# EAGLE design retroduino (EAGLE 9.2.1)
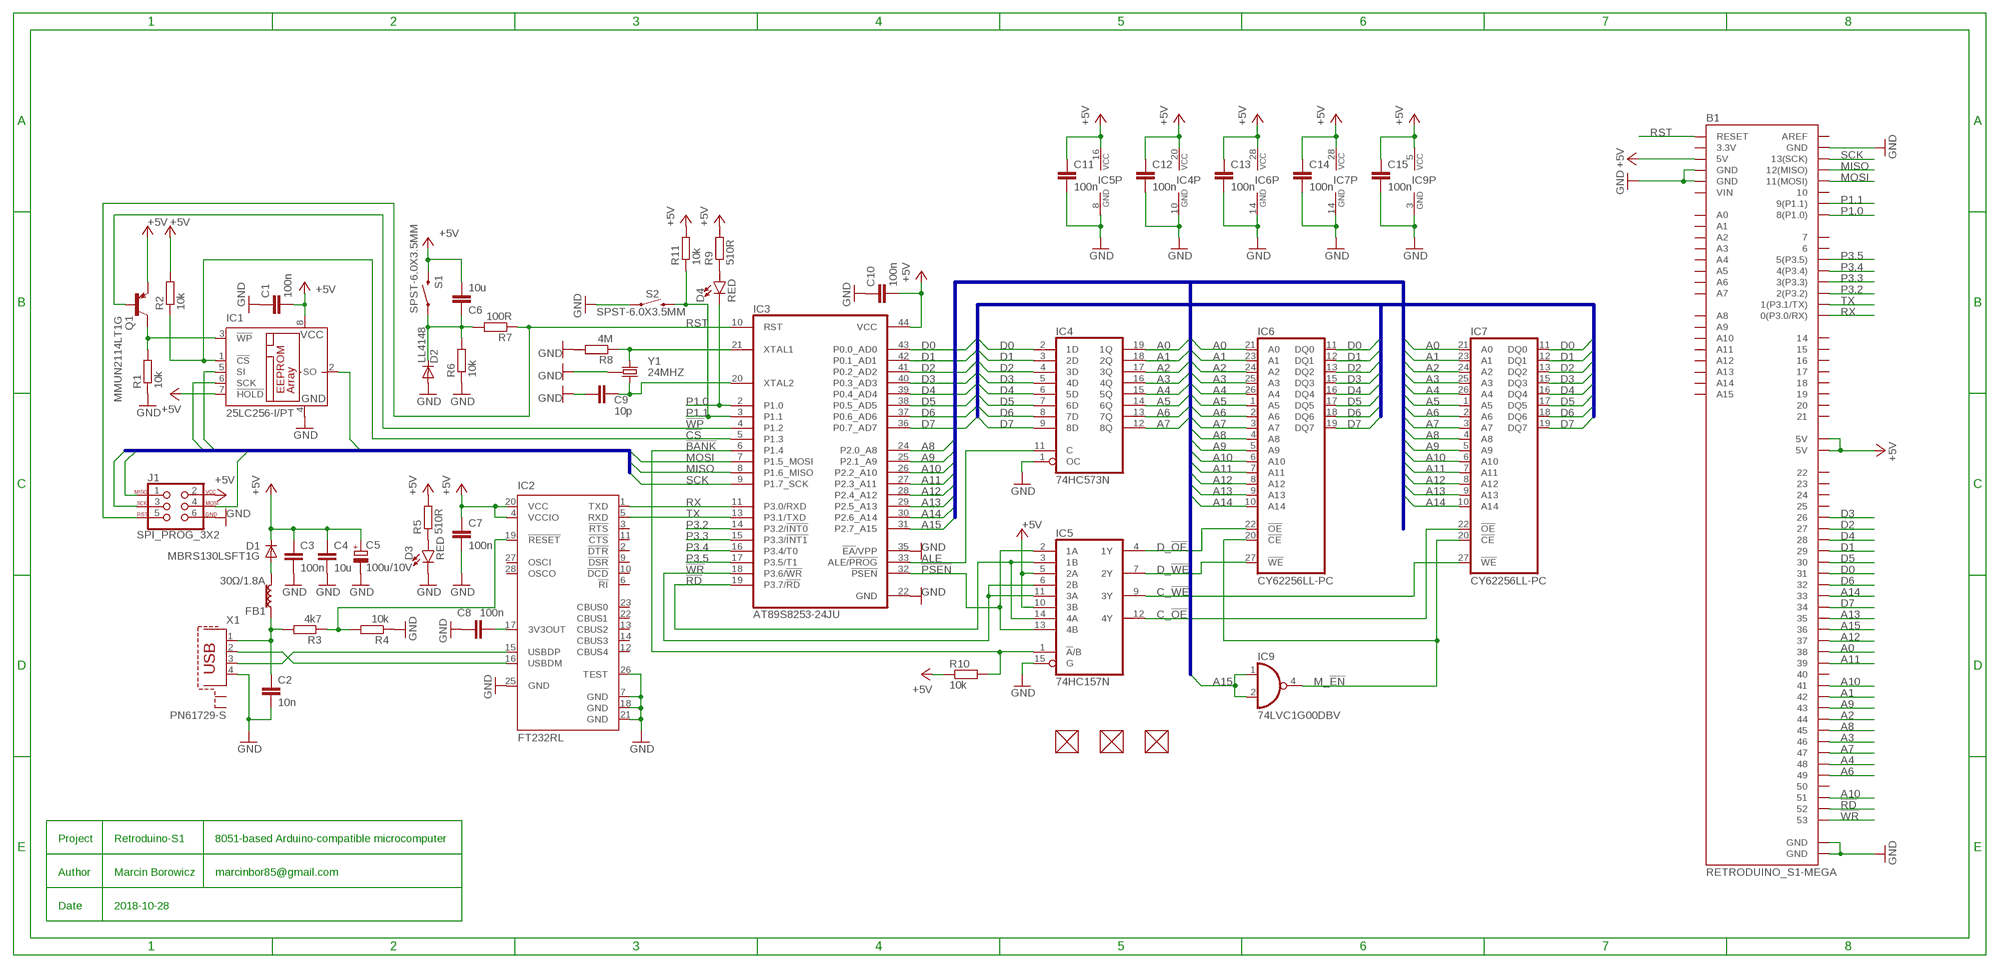
[diagram p0: schematic, sheet 1]

## Parts
B1  RETRODUINO_S1-MEGA  [RETRODUINO_S1]
C1  100n  C-EUC0603  [C0603]
C2  10n  C-EUC0603  [C0603]
C3  100n  C-EUC0603  [C0603]
C4  10u  C-EUC1206  [C1206]
C5  100u/10V  CPOL-EUSMCC  [SMC_C]
C6  10u  C-EUC1206  [C1206]
C7  100n  C-EUC0603  [C0603]
C8  100n  C-EUC0603  [C0603]
C9  10p  C-EUC0603  [C0603]
C10  100n  C-EUC0603  [C0603]
C11  100n  C-EUC0603  [C0603]
C12  100n  C-EUC0603  [C0603]
C13  100n  C-EUC0603  [C0603]
C14  100n  C-EUC0603  [C0603]
C15  100n  C-EUC0603  [C0603]
D1  MBRS130LSFT1G  DIODE-SOD123  [SOD123]
D2  LL4148  DIODE-MICROMELF-R  [MICROMELF-R]
D3  RED  LED-RED0603  [LED-0603]
D4  RED  LED-RED0603  [LED-0603]
FB1  30Ω/1.8A  FERRITE_BEAD-0603  [0603]
FUD1  FIDUCIAL  [GHI_FIDUCIAL_40MIL]
FUD2  FIDUCIAL  [GHI_FIDUCIAL_40MIL]
FUD3  FIDUCIAL  [GHI_FIDUCIAL_40MIL]
IC1  25LC256-I/PT  25LC080P  [DIL8]
IC2  FT232RL  [SSOP28]
IC3  AT89S8253-24JU  AT89S51-S  [S44]
IC4  74HC573N  [DIL20]
IC5  74HC157N  [DIL16]
IC6  CY62256LL-PC  [DIL28-6]
IC7  CY62256LL-PC  [DIL28-6]
IC9  74LVC1G00DBV  [SOT23-5]
J1  SPI_PROG_3X2  AVR_SPI_PROG_3X2NS  [2X3-NS]
Q1  MMUN2114LT1G  BC857BSMD  [SOT23-BEC]
R1  10k  R-EU_R0603  [R0603]
R2  10k  R-EU_R0603  [R0603]
R3  4k7  R-EU_R0603  [R0603]
R4  10k  R-EU_R0603  [R0603]
R5  510R  R-EU_R0603  [R0603]
R6  10k  R-EU_R0603  [R0603]
R7  100R  R-EU_R0603  [R0603]
R8  4M  R-EU_R0603  [R0603]
R9  510R  R-EU_R0603  [R0603]
R10  10k  R-EU_R0603  [R0603]
R11  10k  R-EU_R0603  [R0603]
S1  SPST-6.0X3.5MM  MOMENTARY-SWITCH-SPST-SMD-6.0X3.5MM  [TACTILE_SWITCH_SMD_6.0X3.5MM]
S2  SPST-6.0X3.5MM  MOMENTARY-SWITCH-SPST-SMD-6.0X3.5MM  [TACTILE_SWITCH_SMD_6.0X3.5MM]
X1  PN61729-S  [PN61729-S]
Y1  24MHZ  CRYSTAL-26MHZSMD-3.2X2.5  [CRYSTAL-SMD-3.2X2.5MM]

## Nets
!BANK: IC3.6(P1.4) IC5.1(!A!/B) R10.2
!CS: IC1.1(!CS) IC3.5(P1.3) R2.1
!PSEN: IC3.32(!PSEN) IC5.2(1A) IC5.13(4B)
!RD: B1.52 IC3.19(P3.7/!RD) IC5.3(1B) IC5.14(4A)
!WP: IC3.4(P1.2) Q1.B
!WR: B1.53 IC3.18(P3.6/!WR) IC5.6(2B) IC5.11(3A)
+5V: B1.5V@0(5V) B1.5V@1(5V) B1.5V@2(5V) C1.2 C3.1 C4.1 C5.+ C6.1 C7.1 C10.2 C11.1 C12.1 C13.1 C14.1 C15.1 D1.C IC1.7(!HOLD) IC1.8(VCC) IC2.4(VCCIO) IC2.20(VCC) IC3.44(VCC) IC4.20(VCC) IC5.5(2A) IC5.10(3B) IC5.16(VCC) IC6.28(VCC) IC7.28(VCC) IC9.5(VCC) J1.2 Q1.E R2.2 R5.2 R9.2 R10.1 R11.2 S1.2
A0: B1.38 IC4.19(1Q) IC6.21(A0) IC7.21(A0)
A1: B1.42 IC4.18(2Q) IC6.23(A1) IC7.23(A1)
A2: B1.44 IC4.17(3Q) IC6.24(A2) IC7.24(A2)
A3: B1.46 IC4.16(4Q) IC6.25(A3) IC7.25(A3)
A4: B1.48 IC4.15(5Q) IC6.26(A4) IC7.26(A4)
A5: IC4.14(6Q) IC6.1(A5) IC7.1(A5)
A6: B1.49 IC4.13(7Q) IC6.2(A6) IC7.2(A6)
A7: B1.47 IC4.12(8Q) IC6.3(A7) IC7.3(A7)
A8: B1.45 IC3.24(P2.0_A8) IC6.4(A8) IC7.4(A8)
A9: B1.43 IC3.25(P2.1_A9) IC6.5(A9) IC7.5(A9)
A10: B1.41 B1.51 IC3.26(P2.2_A10) IC6.6(A10) IC7.6(A10)
A11: B1.39 IC3.27(P2.3_A11) IC6.7(A11) IC7.7(A11)
A12: B1.37 IC3.28(P2.4_A12) IC6.8(A12) IC7.8(A12)
A13: B1.35 IC3.29(P2.5_A13) IC6.9(A13) IC7.9(A13)
A14: B1.33 IC3.30(P2.6_A14) IC6.10(A14) IC7.10(A14)
A15: B1.36 IC3.31(P2.7_A15) IC9.1(I0) IC9.2(I1)
ALE: IC3.33(ALE/!PROG) IC4.11(C)
C_!OE: IC5.12(4Y) IC7.22(!OE)
C_!WE: IC5.9(3Y) IC7.27(!WE)
D0: B1.31 IC3.43(P0.0_AD0) IC4.2(1D) IC6.11(DQ0) IC7.11(DQ0)
D1: B1.29 IC3.42(P0.1_AD1) IC4.3(2D) IC6.12(DQ1) IC7.12(DQ1)
D2: B1.27 IC3.41(P0.2_AD2) IC4.4(3D) IC6.13(DQ2) IC7.13(DQ2)
D3: B1.26 IC3.40(P0.3_AD3) IC4.5(4D) IC6.15(DQ3) IC7.15(DQ3)
D4: B1.28 IC3.39(P0.4_AD4) IC4.6(5D) IC6.16(DQ4) IC7.16(DQ4)
D5: B1.30 IC3.38(P0.5_AD5) IC4.7(6D) IC6.17(DQ5) IC7.17(DQ5)
D6: B1.32 IC3.37(P0.6_AD6) IC4.8(7D) IC6.18(DQ6) IC7.18(DQ6)
D7: B1.34 IC3.36(P0.7_AD7) IC4.9(8D) IC6.19(DQ7) IC7.19(DQ7)
D_!OE: IC5.4(1Y) IC6.22(!OE)
D_!WE: IC5.7(2Y) IC6.27(!WE)
GND: B1.GND@0(GND) B1.GND@1(GND) B1.GND@2(GND) B1.GND@3(GND) B1.GND@4(GND) C1.1 C2.2 C3.2 C4.2 C5.- C7.2 C8.2 C9.1 C10.1 C11.2 C12.2 C13.2 C14.2 C15.2 D2.A D3.C IC1.4(GND) IC2.7(GND) IC2.18(GND) IC2.21(GND) IC2.25(GND) IC2.26(TEST) IC3.35(!EA!/VPP) IC4.1(OC) IC4.10(GND) IC5.8(GND) IC5.15(G) IC6.14(GND) IC7.14(GND) IC9.3(GND) J1.6 R1.1 R4.1 R6.1 R8.2 S2.1 X1.4 Y1.2 Y1.4
M_!EN: IC6.20(!CE) IC7.20(!CE) IC9.4(O)
MISO: B1.12(12(MISO)) IC1.2(SO) IC3.8(P1.6_MISO) J1.1
MOSI: B1.11(11(MOSI)) IC1.5(SI) IC3.7(P1.5_MOSI) J1.4
N$9: IC3.22(GND) ; supply symbol labelled GND
N$10: C9.2 IC3.20(XTAL2) Y1.3
N$11: IC3.21(XTAL1) R8.1 Y1.1
N$12: C6.2 D2.C R6.2 R7.2 S1.1
N$20: D3.A R5.1
N$21: D4.A R9.1
N$23: IC2.16(USBDM) X1.2
N$24: C8.1 IC2.17(3V3OUT)
N$25: IC2.15(USBDP) X1.3
N$27: C2.1 FB1.1 R3.2 X1.1
N$29: IC1.3(!WP) Q1.C R1.2
N$31: D1.A FB1.2
N$41: IC2.19(!RESET) R3.1 R4.2
P1.0: B1.8(8(P1.0)) D4.C IC3.2(P1.0)
P1.1: B1.9(9(P1.1)) IC3.3(P1.1) R11.1 S2.2
P3.2: B1.2(2(P3.2)) IC3.14(P3.2/!INT0)
P3.3: B1.3(3(P3.3)) IC3.15(P3.3/!INT1)
P3.4: B1.4(4(P3.4)) IC3.16(P3.4/T0)
P3.5: B1.5(5(P3.5)) IC3.17(P3.5/T1)
RST: B1.RESET IC3.10(RST) J1.5 R7.1
RX: B1.0(0(P3.0/RX)) IC2.1(TXD) IC3.11(P3.0/RXD)
SCK: B1.13(13(SCK)) IC1.6(SCK) IC3.9(P1.7_SCK) J1.3
TX: B1.1(1(P3.1/TX)) IC2.5(RXD) IC3.13(P3.1/TXD)
Unconnected: B1.3V3(3.3V) B1.6 B1.7 B1.10 B1.14 B1.15 B1.16 B1.17 B1.18 B1.19 B1.20 B1.21 B1.22 B1.23 B1.24 B1.25 B1.40 B1.50 B1.A0 B1.A1 B1.A2 B1.A3 B1.A4 B1.A5 B1.A6 B1.A7 B1.A8 B1.A9 B1.A10 B1.A11 B1.A12 B1.A13 B1.A14 B1.A15 B1.AREF B1.VIN FUD1.P$1 FUD2.P$1 FUD3.P$1 IC2.2(!DTR) IC2.3(!RTS) IC2.6(!RI) IC2.9(!DSR) IC2.10(!DCD) IC2.11(!CTS) IC2.12(CBUS4) IC2.13(CBUS2) IC2.14(CBUS3) IC2.22(CBUS1) IC2.23(CBUS0) IC2.27(OSCI) IC2.28(OSCO) X1.S1 X1.S2

## Buses
D:D0,D1,D2,D3,D4,D5,D6,D7
A:A0,A1,A2,A3,A4,A5,A6,A7,A8,A9,A10,A11,A12,A13,A14,A15
SPI:MISO,MOSI,SCK

## Notes on the sheet
- Project | Retroduino-S1 | 8051-based Arduino-compatible microcomputer
- Author | Marcin Borowicz | marcinbor85@gmail.com
- Date | 2018-10-28

## Library data of the parts
B1 = SparkFun-Boards:RETRODUINO_S1: Arduino Mega R3 ATmega2560 R3 compatible footprint. SparkFun Products: Arduino Mega 2560 R3 <https://www.sparkfun.com/products/11061>
C1-C4 C6-C15 = rcl:C-EU: CAPACITOR, European symbol; SPICEPREFIX: C
C5 = rcl:CPOL-EU: POLARIZED CAPACITOR, European symbol; SPICEPREFIX: C
D1 D2 = diode:DIODE-: DIODE
D3 D4 = SparkFun-LED:LED-RED: Red SMD LED Used in manufacturing of most products at SparkFun Packages: 0603 - SMD 0603 package [Product Link] <http://docs.avagotech.com/docs/AV02-0551EN> 0603 SMART - SMD 0603 SMART package ( more efficient and expensive)[Product Link] <http://www.osram-os.com/Graphics/XPic2/00077099_0.pdf> 1206 - SMD1206 package [Product Link] <https://www.sparkfun.com/datasheets/DevTools/LilyPad/Q150OVS4.pdff> SparkFun Products: Pro Mini 328 -5V <https://www.sparkfun.com/products/821> RedBoard <https://www.sparkfun.com/products/12757> IOIO-OTG <https://www.sparkfun.com/products/13613>; PROD_ID: DIO-00819
FB1 = SparkFun-Coils:FERRITE_BEAD: Ferrite Bead (blocks, cores, rings, chokes, etc.) Inductor with layers of ferrite used to suppress high frequencies. Often used to isolate high frequency noise. SparkFun Products: IOIO-OTG - V2.2 <https://www.sparkfun.com/products/13613> SparkFun SAMD21 Mini Breakout <https://www.sparkfun.com/products/13664> SparkFun 6 Degrees of Freedom Breakout - LSM6DS3 <https://www.sparkfun.com/products/13339> SparkFun SAMD21 Dev Breakout <https://www.sparkfun.com/products/13672>; PROD_ID: NDUC-07859
FUD1-FUD3 = BeagleBone_Blue_R3:FIDUCIAL
IC1 = microchip:25*: Serial EEPROM 4K/ 8K , SPI bus; MF: MICROCHIP; MPN: 25LC080/P; OC_FARNELL: 1556143; OC_NEWARK: 92C7440
IC2 = ftdichip:FT232R: Source: http://www.ftdichip.com/Documents/DataSheets/DS_FT232R_v104.pdf; MPN: FT232RL; OC_FARNELL: 1146032; OC_NEWARK: 91K9918
IC3 = atmel:AT89S51-*: 8-bit Microcontroller with 4K BytesIn-System Programmable Flash Source: http://www.atmel.com/dyn/resources/prod_documents/doc2487.pdf; OC_FARNELL: unknown; OC_NEWARK: unknown
IC4 = 74xx-eu:74*573: 8-bit D latch BUS DRIVER
IC5 = 74xx-eu:74*157: Quadruple 2-line to 1-line data SELECTOR/MULTIPLEXER
IC6 IC7 = memory-sram:CY62256LL-?*: 256K (32K x 8) CMOS-Static RAM Source: http://download.cypress.com.edgesuite.net/design_resources/datasheets/contents/cy62256_8.pdf
IC9 = 74xx-little-de:74*1G00: 2-input NAND gate
J1 = SparkFun-Connectors:AVR_SPI_PROG_3X2: AVR ISP 6 Pin This is the reduced ISP connector for AVR programming. Common on Arduino. This footprint will take up less PCB space and can be used with a 10-pin to 6-pin adapter such as SKU: BOB-08508 **Special note about "TEST_POINT" package. The stop mask is on the top side, so if you want your programming test points to be on the bottom of your board, make sure to place this package on the bottom side of the board. This also ensure that the orientation to program from the bottom side will be correct. SparkFun Products: SparkFun ISP Pogo Adapter <https://www.sparkfun.com/products/11591> - NS Tiny AVR Programmer <https://www.sparkfun.com/products/11801> -PTH
Q1 = transistor-pnp:BC857*: PNP Transistror
R1-R11 = rcl:R-EU_: RESISTOR, European symbol; SPICEPREFIX: R
S1 S2 = SparkFun-Switches:MOMENTARY-SWITCH-SPST: Momentary Switch (Pushbutton) - SPST Normally-open (NO) SPST momentary switches (buttons, pushbuttons). Variants PTH-12MM - 12mm square, through-hole Momentary Pushbutton Switch - 12mm Square <https://www.sparkfun.com/products/9190> (COM-09190) PTH-6.0MM, PTH-6.0MM-KIT - 6.0mm square, through-hole Mini Pushbutton Switch <https://www.sparkfun.com/products/97> (COM-00097) KIT package intended for soldering kit's - only one side of pads' copper is exposed. PTH-RIGHT-ANGLE-KIT - Right-angle, through-hole Right Angle Tactile Button <https://www.sparkfun.com/products/10791> - Used on SparkFun BigTime Watch Kit <https://www.sparkfun.com/products/11734> SMD-12MM - 12mm square, surface-mount Tactile Button - SMD (12mm) <https://www.sparkfun.com/products/12993> (COM-12993) Used on SparkFun PicoBoard <https://www.sparkfun.com/products/11888> SMD-4.5MM - 4.5mm Square Trackball Switch Used on SparkFun Blackberry Trackballer Breakout <https://www.sparkfun.com/products/13169> SMD-4.6MMX2.8MM - 4.60mm x 2.80mm, surface mount Used on SparkFun SAMD21 Mini Breakout <https://www.sparkfun.com/products/13664> SMD-5.2MM, SMD-5.2-REDUNDANT - 5.2mm square, surface-mount Mini Pushbutton Switch - SMD <https://www.sparkfun.com/products/8720> (COM-08720) Used on Arduino Pro Mini <https://www.sparkfun.com/products/11114> REDUNDANT package connects both switch circuits together SMD-6.0X3.5MM - 6.0 x 3.5mm, surface mount Momentary Reset Switch SMD <https://www.sparkfun.com/products/8229> (COM-08229) SMD-6.2MM-TALL - 6.2mm square, surface mount Tactile Button - SMD (6mm) <https://www.sparkfun.com/products/12992> Used on SparkFun Digital Sandbox <https://www.sparkfun.com/products/12651> SMD-RIGHT-ANGLE - Right-angle, surface mount Used on SparkFun Block for Intel® Edison - Arduino <https://www.sparkfun.com/products/13036>; PROD_ID: SWCH-00815; SF_SKU: COM-08229
X1 = con-berg:PN61729-S: BERG USB connector; OC_FARNELL: unknown; OC_NEWARK: unknown
Y1 = SparkFun-Clocks:CRYSTAL-26MHZ: 26MHz Crystal w/ Ground Pin Digikey Example <http://www.digikey.com/product-detail/en/epson/TSX-3225%2026.0000MF09Z-AC3/SER3627CT-ND/1802878> Frequency: 26MHz Frequency Stability: ±9ppm Frequency Tolerance: ±10ppm Load Capacitance: 9pF SparkFun Products: SparkFun ESP32 Thing <https://www.sparkfun.com/products/13907> SparkFun ESP8266 Thing Dev Board <https://www.sparkfun.com/products/13711>; PROD_ID: XTAL-12454

## Board
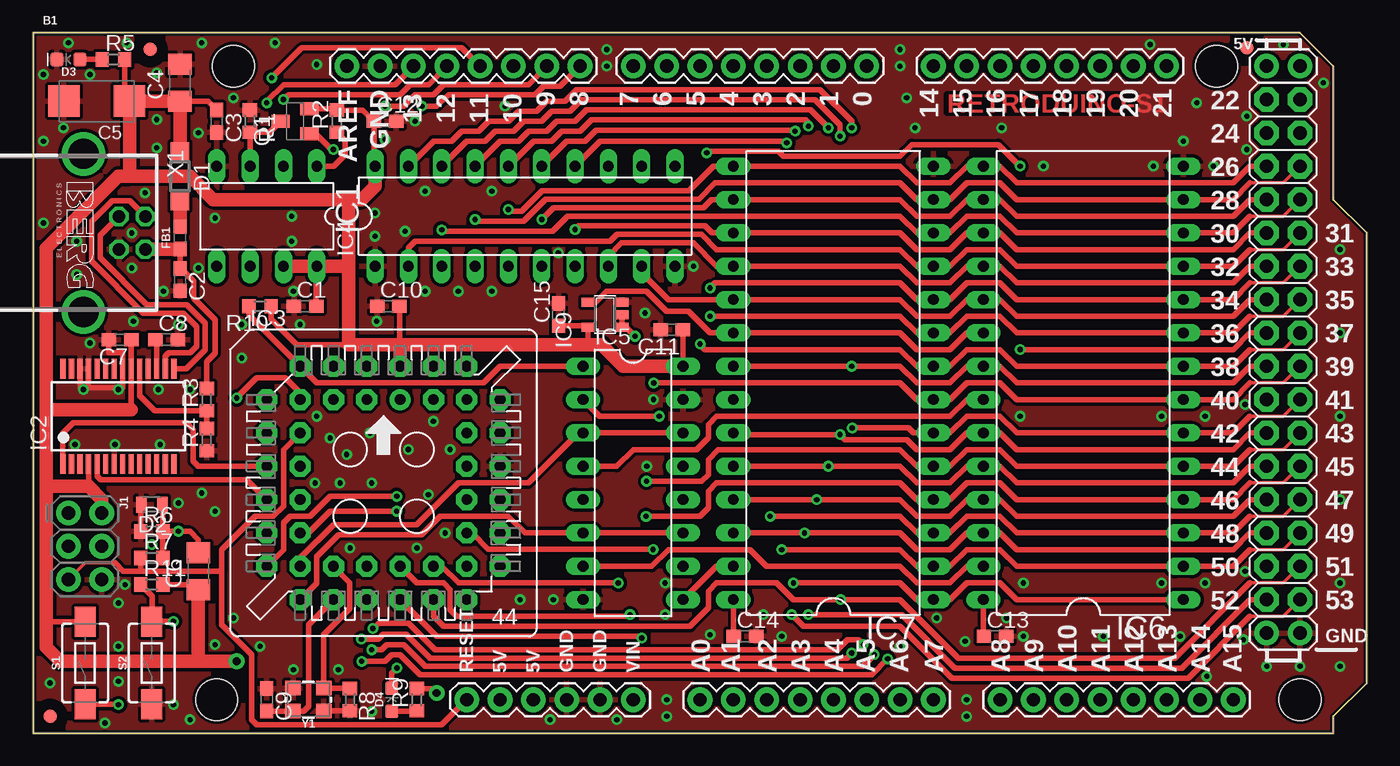
[diagram p1: board, top side]
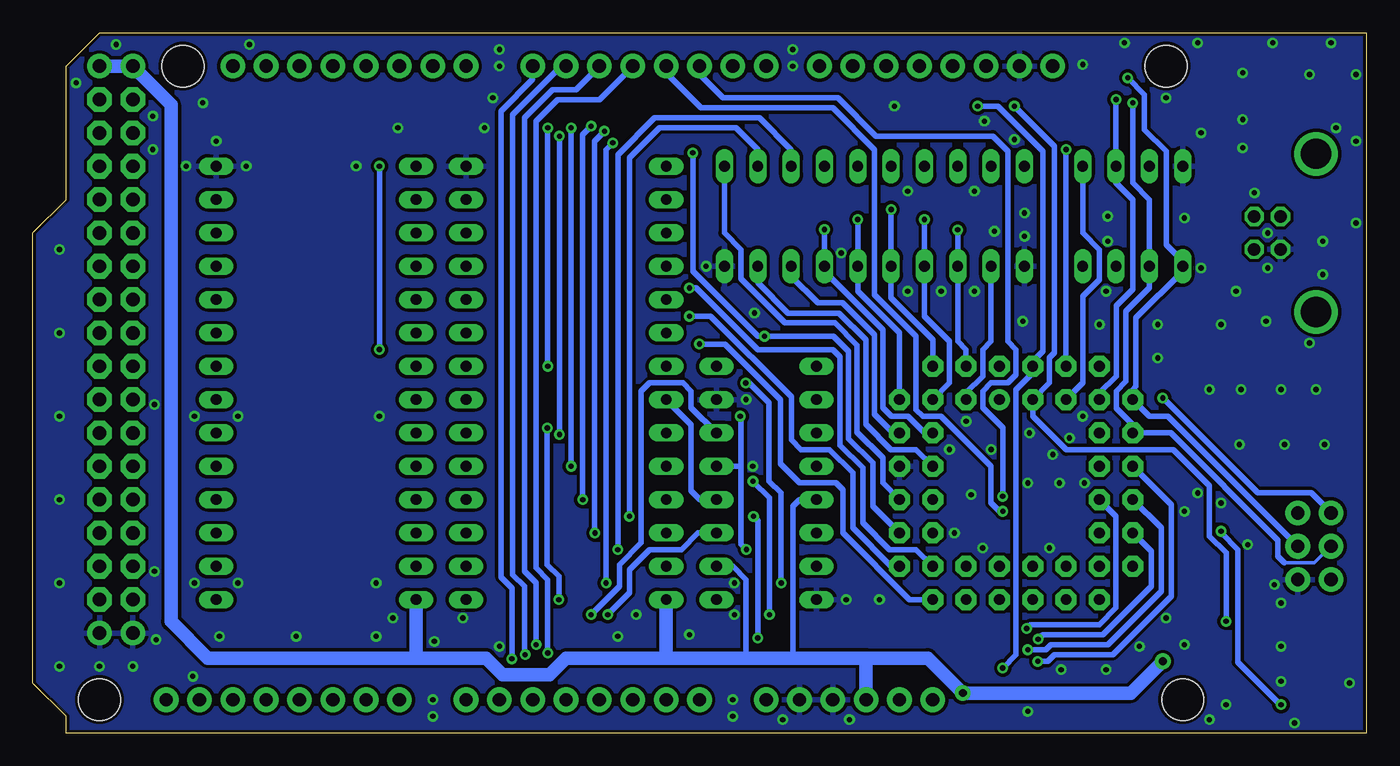
[diagram p2: board, bottom side, seen from below]

Size 101.6 x 53.34 mm. Coordinates in mm from the lower left corner, seen from the top.
Outline: 0,0 99.06,0 99.06,1.27 101.6,3.81 101.6,38.1 99.06,40.64 99.06,50.8 96.52,53.34 0,53.34 0,0
Copper layers (1*16): Top 0.035mm / dielectric 1.5mm / Bottom 0.035mm
Design rules "default *": minimum track width 0.25mm, minimum drill 0.4mm, track to track 0.2mm, track to pad 0.2mm, pad to pad 0.2mm, via to via 0.2mm, smd to smd 0.2mm, copper to edge 0.2mm, drill to drill 0.2mm, minimum pad ring 10mil, minimum via ring 8mil, stop-mask expansion 4mil, vias tented up to drill 0.6mm, thermal gap 10mil

### Footprints (pad centres in the part's own frame; a part is rotated, then mirrored left to right if it is on the bottom)
RETRODUINO_S1 = drill 1.016 pad 1.88: 0 13.97,24.13; 1 11.43,24.13; 2 8.89,24.13; 3 6.35,24.13; 3V3 -13.97,-24.13; 4 3.81,24.13; 5 1.27,24.13; 5V@0 -11.43,-24.13; 5V@1 44.45,24.13; 5V@2 46.99,24.13; 6 -1.27,24.13; 7 -3.81,24.13; 8 -7.874,24.13; 9 -10.414,24.13; 10 -12.954,24.13; 11 -15.494,24.13; 12 -18.034,24.13; 13 -20.574,24.13; 14 19.05,24.13; 15 21.59,24.13; 16 24.13,24.13; 17 26.67,24.13; 18 29.21,24.13; 19 31.75,24.13; 20 34.29,24.13; 21 36.83,24.13; A0 1.27,-24.13; A1 3.81,-24.13; A2 6.35,-24.13; A3 8.89,-24.13; A4 11.43,-24.13; A5 13.97,-24.13; A6 16.51,-24.13; A7 19.05,-24.13; A8 24.13,-24.13; A9 26.67,-24.13; A10 29.21,-24.13; A11 31.75,-24.13; A12 34.29,-24.13; A13 36.83,-24.13; A14 39.37,-24.13; A15 41.91,-24.13; AREF -25.654,24.13; GND@0 -8.89,-24.13; GND@1 -6.35,-24.13; GND@2 44.45,-19.05; GND@3 46.99,-19.05; GND@4 -23.114,24.13; RESET -16.51,-24.13; VIN -3.81,-24.13 | drill 1.016 pad 1.88 octagon: 22 44.45,21.59; 23 46.99,21.59; 24 44.45,19.05; 25 46.99,19.05; 26 44.45,16.51; 27 46.99,16.51; 28 44.45,13.97; 29 46.99,13.97; 30 44.45,11.43; 31 46.99,11.43; 32 44.45,8.89; 33 46.99,8.89; 34 44.45,6.35; 35 46.99,6.35; 36 44.45,3.81; 37 46.99,3.81; 38 44.45,1.27; 39 46.99,1.27; 40 44.45,-1.27; 41 46.99,-1.27; 42 44.45,-3.81; 43 46.99,-3.81; 44 44.45,-6.35; 45 46.99,-6.35; 46 44.45,-8.89; 47 46.99,-8.89; 48 44.45,-11.43; 49 46.99,-11.43; 50 44.45,-13.97; 51 46.99,-13.97; 52 44.45,-16.51; 53 46.99,-16.51 | hole 3.2: -34.29,24.13; -35.56,-24.13; 40.64,24.13; 46.99,-24.13
C0603 = smd 1.1 x 1: 1 -0.85,0; 2 0.85,0
C1206 = smd 1.6 x 1.8: 1 -1.4,0; 2 1.4,0
SMC_C = smd 2.4 x 2.4: + -2.5,0; - 2.5,0
SOD123 = smd 1.4 x 1.4: A 1.9,0; C -1.9,0
MICROMELF-R = smd 0.8 x 1.2: A 0.8,0; C -0.8,0
LED-0603 = smd 1 x 1: A -0.877,0; C 0.877,0
0603 = smd 1.1 x 1: 1 -0.85,0; 2 0.85,0
GHI_FIDUCIAL_40MIL = smd 1.016 x 1.016: P$1 0,0
DIL8 = drill 0.813 long: 1 -3.81,-3.81; 2 -1.27,-3.81; 3 1.27,-3.81; 4 3.81,-3.81; 5 3.81,3.81; 6 1.27,3.81; 7 -1.27,3.81; 8 -3.81,3.81
SSOP28 = smd 0.4 x 1.5: 1 -4.225,-3.625; 2 -3.575,-3.625; 3 -2.925,-3.625; 4 -2.275,-3.625; 5 -1.625,-3.625; 6 -0.975,-3.625; 7 -0.325,-3.625; 8 0.325,-3.625; 9 0.975,-3.625; 10 1.625,-3.625; 11 2.275,-3.625; 12 2.925,-3.625; 13 3.575,-3.625; 14 4.225,-3.625; 15 4.225,3.625; 16 3.575,3.625; 17 2.925,3.625; 18 2.275,3.625; 19 1.625,3.625; 20 0.975,3.625; 21 0.325,3.625; 22 -0.325,3.625; 23 -0.975,3.625; 24 -1.625,3.625; 25 -2.275,3.625; 26 -2.925,3.625; 27 -3.575,3.625; 28 -4.225,3.625
S44 = drill 0.813 pad 1.6: 1 1.27,6.35 | drill 0.813 pad 1.6 octagon: 2 -1.27,8.89; 3 -1.27,6.35; 4 -3.81,8.89; 5 -3.81,6.35; 6 -6.35,8.89; 7 -8.89,6.35; 8 -6.35,6.35; 9 -8.89,3.81; 10 -6.35,3.81; 11 -8.89,1.27; 12 -6.35,1.27; 13 -8.89,-1.27; 14 -6.35,-1.27; 15 -8.89,-3.81; 16 -6.35,-3.81; 17 -8.89,-6.35; 18 -6.35,-8.89; 19 -6.35,-6.35; 20 -3.81,-8.89; 21 -3.81,-6.35; 22 -1.27,-8.89; 23 -1.27,-6.35; 24 1.27,-8.89; 25 1.27,-6.35; 26 3.81,-8.89; 27 3.81,-6.35; 28 6.35,-8.89; 29 8.89,-6.35; 30 6.35,-6.35; 31 8.89,-3.81; 32 6.35,-3.81; 33 8.89,-1.27; 34 6.35,-1.27; 35 8.89,1.27; 36 6.35,1.27; 37 8.89,3.81; 38 6.35,3.81; 39 8.89,6.35; 40 6.35,8.89; 41 6.35,6.35; 42 3.81,8.89; 43 3.81,6.35; 44 1.27,8.89
DIL20 = drill 0.813 long: 1 -11.43,-3.81; 2 -8.89,-3.81; 3 -6.35,-3.81; 4 -3.81,-3.81; 5 -1.27,-3.81; 6 1.27,-3.81; 7 3.81,-3.81; 8 6.35,-3.81; 9 8.89,-3.81; 10 11.43,-3.81; 11 11.43,3.81; 12 8.89,3.81; 13 6.35,3.81; 14 3.81,3.81; 15 1.27,3.81; 16 -1.27,3.81; 17 -3.81,3.81; 18 -6.35,3.81; 19 -8.89,3.81; 20 -11.43,3.81
DIL16 = drill 0.813 long: 1 -8.89,-3.81; 2 -6.35,-3.81; 3 -3.81,-3.81; 4 -1.27,-3.81; 5 1.27,-3.81; 6 3.81,-3.81; 7 6.35,-3.81; 8 8.89,-3.81; 9 8.89,3.81; 10 6.35,3.81; 11 3.81,3.81; 12 1.27,3.81; 13 -1.27,3.81; 14 -3.81,3.81; 15 -6.35,3.81; 16 -8.89,3.81
DIL28-6 = drill 0.813 long: 1 -16.51,-7.62; 2 -13.97,-7.62; 3 -11.43,-7.62; 4 -8.89,-7.62; 5 -6.35,-7.62; 6 -3.81,-7.62; 7 -1.27,-7.62; 8 1.27,-7.62; 9 3.81,-7.62; 10 6.35,-7.62; 11 8.89,-7.62; 12 11.43,-7.62; 13 13.97,-7.62; 14 16.51,-7.62; 15 16.51,7.62; 16 13.97,7.62; 17 11.43,7.62; 18 8.89,7.62; 19 6.35,7.62; 20 3.81,7.62; 21 1.27,7.62; 22 -1.27,7.62; 23 -3.81,7.62; 24 -6.35,7.62; 25 -8.89,7.62; 26 -11.43,7.62; 27 -13.97,7.62; 28 -16.51,7.62
SOT23-5 = smd 0.69 x 0.99: 1 -0.95,-1.29; 2 0,-1.29; 3 0.95,-1.29; 4 0.95,1.3; 5 -0.95,1.3
2X3-NS = drill 1.016 pad 1.88: 1 -2.54,-1.27; 2 -2.54,1.27; 3 0,-1.27; 4 0,1.27; 5 2.54,-1.27; 6 2.54,1.27
SOT23-BEC = smd 1 x 1.4: B -0.95,-1.1; C 0,1.1; E 0.95,-1.1
R0603 = smd 1 x 1.1: 1 -0.85,0; 2 0.85,0
TACTILE_SWITCH_SMD_6.0X3.5MM = smd 2.3 x 1.6: 1 -3.15,0; 2 3.15,0
PN61729-S = drill 0.95 octagon: 1 1.25,4.71; 2 -1.25,4.71; 3 -1.25,2.71; 4 1.25,2.71 | drill 2.3 pad 2.9: S1 -6.02,0; S2 6.02,0
CRYSTAL-SMD-3.2X2.5MM = smd 1.2 x 1.1: 1 -1.175,-0.875; 2 1.175,-0.875; 3 1.175,0.875; 4 -1.175,0.875

### Placement (x,y rotation side)
B1  49.53,26.67 0 top
C1  20.7,32.51 0 top
C2  11.18,34.54 270 top
C3  13.97,46.61 270 top
C4  11.18,49.53 90 top
C5  4.83,48.13 180 top
C6  12.57,12.32 90 top
C7  6.6,29.97 180 top
C8  10.16,29.97 0 top
C9  17.78,2.54 270 top
C10  27.05,32.51 0 top
C11  48.64,30.73 180 top
C12  26.8,46.61 0 top
C13  73.28,7.37 0 top
C14  54.23,7.37 0 top
C15  40.01,31.88 90 top
D1  11.18,42.42 270 top
D2  9.02,17.4 180 top
D3  2.67,51.31 180 top
D4  27.3,2.54 90 top
FB1  11.18,37.72 90 top
FUD1  8.89,52.07 0 top
FUD2  92.46,52.2 0 top
FUD3  1.27,1.27 0 top
IC1  17.78,39.37 180 top
IC2  6.48,24.13 0 top
IC3  26.67,19.05 0 top
IC4  37.47,39.37 0 top
IC5  45.69,19.05 270 top
IC6  80.01,26.67 90 top
IC7  60.96,26.67 90 top
IC9  43.56,31.88 90 top
J1  3.94,14.22 270 top
Q1  19.94,46.61 90 top
R1  16.51,46.61 270 top
R2  23.11,46.61 90 top
R3  13.21,25.4 90 top
R4  13.21,22.35 90 top
R5  6.1,51.31 0 top
R6  9.02,15.37 0 top
R7  9.02,13.34 0 top
R8  24.13,2.54 270 top
R9  29.21,2.54 90 top
R10  17.27,32.51 180 top
R11  9.02,11.3 0 top
S1  3.94,5.33 90 top
S2  9.02,5.33 90 top
X1  3.81,38.1 270 top
Y1  20.95,2.54 180 top

### Tracks (layer width: path | path; a pad name or v marks a point on that pad's centre or on a via)
!BANK
  Top 0.4: IC5.1 35.56,27.94 34.29,26.67 21.59,26.67 IC3.6 16.42,31.84 R10.2
!CS
  Top 0.4: R2.1 23.75,45.12 23.75,44.07 22.86,43.18 IC1.1
  Bottom 0.4: IC3.5 21.57,26.69 21.57,33.28 20.32,34.53 20.32,36.83 21.59,38.1 IC1.1
!PSEN  (via drill 0.4)
  Top 0.4: IC3.32 33.41,15.24 34.66,13.99 v47.22,13.99 | IC5.2 43.16,24.13 v47.69,24.13
  Bottom 0.4: v47.69,24.13 47.62,24.07 47.62,20.32 | IC5.13 47.62,20.32 | 47.62,20.32 47.62,14.39 v47.22,13.99
!RD  (via drill 0.4)
  Top 0.4: IC3.19 20.32,13.34 22.86,15.88 29.21,15.88 32.38,19.05 37.72,19.05 41.53,22.86 IC5.3 IC5.14 | v59.05,9.02 66.17,9.02 70.23,4.95 87.5,4.95 92.71,10.16 B1.52
  Bottom 0.4: IC5.14 51.44,24.79 51.44,26.04 52.07,26.67 54.61,26.67 55.24,26.04 55.24,14.48 56.9,12.83 56.9,11.18 v59.05,9.02
!WP  (via drill 0.4)
  Top 0.4: v22.86,44.45 22.73,44.45 21.52,45.66 Q1.B
  Bottom 0.4: IC3.4 v22.86,44.45
!WR  (via drill 0.4)
  Top 0.25: 92.71,8.89 95.25,8.89 B1.53
  Top 0.4: IC3.18 21.57,11.41 21.57,13.44 23.24,15.11 29.59,15.11 30.99,16.51 36.18,16.51 37.45,15.24 IC5.6 IC5.11 | v57.78,9.02 58.67,8.13 66.04,8.13 69.98,4.19 88.01,4.19 92.71,8.89
  Bottom 0.4: IC5.11 50.9,15.24 52.17,13.97 54.61,13.97 56.13,12.45 56.13,10.67 v57.78,9.02
+5V  (via drill 0.6 pad 1.2)
  Top 0.4: C7.1 IC2.20 7.45,24.64 | IC2.4 4.2,18.8 | R5.2 6.95,48.51 | C11.1 49.49,27.95 IC5.16 | v30.73,3.05 30.7,3.05 30.35,3.39 R9.2 | IC7.28 53.34,7.41 C14.1 | IC6.28 72.39,7.41 C13.1 | S1.2 0.99,8.48 | R11.2 12.19,11.3 C6.1 | C3.1 13.3,48.13 C4.1 | Q1.E 23.01,47.56 R2.2 25.1,47.46 C12.1 25.95,43.27 IC4.20 | C1.2 21.55,35.52 | C10.2 27.9,29.63 27.94,29.59 | C15.1 42.16,31.03 IC9.5 42.26,29.94 41.91,29.59 | R10.1 18.12,31.54 20.07,29.59 24,29.59
  Top 1.016: IC1.8 IC1.7 | 27.94,29.59 IC3.44 | 21.55,35.52 IC1.8 | 24,40.64 13.72,40.64 11.94,42.42 7.37,42.42 | 24,40.64 24,35.56 | 24,35.56 24,29.59 27.94,29.59 | IC1.8 24,35.56 | J1.2 5.21,17.78 4.2,18.79 | C5.+ 7.37,48.09 arc90 C5.+ 7.33,42.46 7.37,42.42 | 7.37,42.42 6.48,42.42 0.97,36.91 0.97,24.64 | 24,40.64 25.02,40.64 26.04,41.66 IC4.20 | C5.+ C4.1 D1.C | 6.95,48.51 C5.+ | IC5.16 44.92,27.94 43.29,29.59 41.91,29.59 27.94,29.59 | 4.2,18.8 4.2,18.79 | 0.97,18.8 0.97,24.64 | 7.45,24.64 0.97,24.64 | 4.2,18.79 0.98,18.79 0.97,18.8 | 0.97,18.8 0.97,8.51 | 0.97,8.51 0.97,6.52 2.03,5.46 12.7,5.46 | 12.7,5.46 v15.49,5.46 | 0.99,8.48 0.97,8.51 | C6.1 12.57,5.59 12.7,5.46
  Bottom 0.4: IC5.5 43.18,17.78 43.69,17.27 43.69,5.71 | IC5.10 48.26,12.7 47.24,11.68 47.24,5.71
  Bottom 1.016: v15.49,5.46 17.91,3.05 v30.73,3.05 33.4,5.71 38.1,5.71 | B1.5V@0 38.1,5.71 | IC7.28 53.34,5.71 | 38.1,5.71 43.69,5.71 47.24,5.71 53.34,5.71 | 53.34,5.71 60.96,5.71 62.23,4.45 65.79,4.45 67.06,5.71 72.39,5.71 | B1.5V@2 B1.5V@1 91.06,47.88 91.06,8.51 88.27,5.71 72.39,5.71 | IC6.28 72.39,5.71
A0  (via drill 0.4)
  Top 0.4: IC7.21 v62.36,27.94 66.04,27.94 67.31,26.67 69.85,26.67 71.12,27.94 IC6.21 73.66,27.94 74.93,26.67 91.44,26.67 92.71,27.94 B1.38 | IC4.19 30.48,45.09 31.88,45.09 32.64,45.85 33.91,45.85 34.67,46.61 36.2,46.61 36.96,47.37 38.35,47.37 39.12,48.13 40.51,48.13 41.4,49.02 59.94,49.02 62.36,46.61 v62.36,46.1
  Bottom 0.4: v62.36,46.1 v62.36,27.94
A1  (via drill 0.4)
  Top 0.4: IC7.23 53.47,22.73 v61.47,22.73 61.85,22.35 66.55,22.35 67.31,21.59 69.85,21.59 71.12,22.86 IC6.23 73.66,22.86 74.93,21.59 91.44,21.59 92.71,22.86 B1.42 | IC4.18 33.02,45.09 34.42,45.09 35.18,45.85 36.58,45.85 37.34,46.61 38.73,46.61 39.5,47.37 40.89,47.37 41.78,48.26 59.56,48.26 61.47,46.35 v61.47,45.47
  Bottom 0.4: v61.47,45.47 v61.47,22.73
A2  (via drill 0.4)
  Top 0.4: IC7.24 v60.58,20.32 66.04,20.32 67.31,19.05 69.85,19.05 71.12,20.32 IC6.24 73.66,20.32 74.93,19.05 91.44,19.05 92.71,20.32 B1.44 | IC4.17 35.56,45.09 36.96,45.09 37.72,45.85 39.12,45.85 39.88,46.61 41.27,46.61 42.15,47.48 59.2,47.48 v60.58,46.1 | v60.58,46.1 | v60.58,46.1
  Bottom 0.4: v60.58,20.32 v60.58,46.1
A3  (via drill 0.4)
  Top 0.4: IC7.25 v59.69,17.78 66.04,17.78 67.31,16.51 69.85,16.51 71.12,17.78 IC6.25 73.66,17.78 74.93,16.51 91.44,16.51 92.71,17.78 B1.46 | IC4.16 38.1,45.09 39.5,45.09 40.26,45.85 41.66,45.85 42.52,46.71 58.83,46.71 59.05,46.48 v59.05,46.23
  Bottom 0.4: v59.05,46.23 59.69,45.59 v59.69,17.78
A4  (via drill 0.4)
  Top 0.4: IC7.26 v58.77,15.24 66.04,15.24 67.31,13.97 69.85,13.97 71.12,15.24 IC6.26 73.66,15.24 74.93,13.97 91.44,13.97 92.71,15.24 B1.48 | IC4.15 40.64,45.09 42.04,45.09 42.88,45.93 57.96,45.93 v58.04,45.85
  Bottom 0.4: v58.77,15.24 58.8,15.28 58.8,45.09 v58.04,45.85
A5  (via drill 0.4)
  Top 0.4: IC6.1 74.93,10.16 73.66,11.43 71.12,11.43 69.85,10.16 IC7.1 67.31,10.16 66.04,11.43 v57.91,11.43 | IC4.14 43.18,45.09 57.28,45.09 v57.4,44.96
  Bottom 0.4: v57.4,44.96 57.91,44.45 v57.91,11.43
A6  (via drill 0.4)
  Top 0.25: 92.71,13.97 95.25,13.97 B1.49
  Top 0.4: v57.02,13.97 66.04,13.97 67.31,12.7 IC7.2 69.85,12.7 71.12,13.97 73.66,13.97 74.93,12.7 IC6.2 91.44,12.7 92.71,13.97
  Bottom 0.4: v57.02,13.97 57.02,44.07 54.23,46.86 46.23,46.86 43.81,44.45 IC4.13
A7  (via drill 0.4)
  Top 0.25: 92.71,16.51 95.25,16.51 B1.47
  Top 0.4: v56.13,16.51 66.04,16.51 67.31,15.24 IC7.3 69.85,15.24 71.12,16.51 73.66,16.51 74.93,15.24 IC6.3 91.44,15.24 92.71,16.51
  Bottom 0.4: IC4.12 46.35,44.45 48.01,46.1 53.85,46.1 56.13,43.81 v56.13,16.51
A8  (via drill 0.4)
  Top 0.25: 92.71,19.05 95.25,19.05 B1.45
  Top 0.4: v46.68,16.51 50.8,16.51 51.44,17.14 51.44,18.41 52.07,19.05 66.04,19.05 67.31,17.78 IC7.4 69.85,17.78 71.12,19.05 73.66,19.05 74.93,17.78 IC6.4 91.44,17.78 92.71,19.05 | IC3.24 30.73,7.37 46.23,7.37 v46.35,7.24
  Bottom 0.4: v46.68,16.51 46.35,16.18 v46.35,7.24
A9  (via drill 0.4)
  Top 0.25: 92.71,21.59 95.25,21.59 B1.43
  Top 0.4: v46.72,19.18 50.93,19.18 51.44,19.68 51.44,20.83 52.18,21.59 66.04,21.59 67.31,20.32 IC7.5 69.85,20.32 71.12,21.59 73.66,21.59 74.93,20.32 IC6.5 91.44,20.32 92.71,21.59 | v45.47,9.02 45.34,8.89 32.26,8.89 31.75,9.4 31.75,10.92 31.24,11.43 29.21,11.43 IC3.25
  Bottom 0.4: v46.72,19.18 46.72,19.16 45.47,17.91 v45.47,9.02
A10  (via drill 0.4)
  Top 0.25: 92.71,11.43 95.25,11.43 B1.51 | 92.71,24.13 95.25,24.13 B1.41
  Top 0.4: v62.4,23.24 66.67,23.24 67.06,22.86 IC7.6 69.85,22.86 71.12,24.13 73.66,24.13 74.93,22.86 IC6.6 91.44,22.86 92.71,24.13 | IC3.26 30.48,8.89 31.24,8.13 50.04,8.13 51.44,9.53 51.44,10.79 52.07,11.43 56.64,11.43 57.91,10.16 v61.51,10.16 66.04,10.16 70.48,5.71 87,5.71 92.71,11.43
  Bottom 0.4: v62.4,23.24 62.4,12.83 61.51,11.94 v61.51,10.16
A11  (via drill 0.4)
  Top 0.25: 92.71,26.67 95.25,26.67 B1.39
  Top 0.4: v47.26,26.67 66.04,26.67 67.31,25.4 IC7.7 69.85,25.4 71.12,26.67 73.66,26.67 74.93,25.4 IC6.7 91.44,25.4 92.71,26.67 | v44.58,11.43 32.38,11.43 31.11,12.7 IC3.27
  Bottom 0.4: v47.26,26.67 47.01,26.67 45.49,25.15 45.49,19.2 44.58,18.29 v44.58,11.43
A12  (via drill 0.4)
  Top 0.25: 92.71,29.21 95.25,29.21 B1.37
  Top 0.4: v50.8,29.63 50.8,29.59 51.18,29.21 66.04,29.21 67.31,27.94 IC7.8 69.85,27.94 71.12,29.21 73.66,29.21 74.93,27.94 IC6.8 91.44,27.94 92.71,29.21
  Bottom 0.4: v50.8,29.63 48.86,29.63 44.63,25.39 44.63,20.5 43.18,19.05 40.39,19.05 39.88,18.54 39.88,15.25 34.79,10.16 IC3.28
A13  (via drill 0.4)
  Top 0.25: 92.71,31.75 95.25,31.75 B1.35
  Top 0.4: v51.56,31.75 66.04,31.75 67.31,30.48 IC7.9 69.85,30.48 71.12,31.75 73.66,31.75 74.93,30.48 IC6.9 91.44,30.48 92.71,31.75
  Bottom 0.4: IC3.29 36.2,12.7 39.12,15.62 39.12,19.81 40.89,21.59 43.05,21.59 43.8,22.34 43.8,25.61 49.94,31.75 v51.56,31.75
A14  (via drill 0.4)
  Top 0.25: 92.71,34.29 95.25,34.29 B1.33
  Top 0.4: v51.56,33.91 51.94,34.29 66.04,34.29 67.31,33.02 IC7.10 69.85,33.02 71.12,34.29 73.66,34.29 74.93,33.02 IC6.10 91.44,33.02 92.71,34.29
  Bottom 0.4: IC3.30 34.29,13.97 36.32,13.97 38.35,16 38.35,20.19 40.08,21.92 40.08,28.65 40.64,29.21 46.35,29.21 51.05,33.91 v51.56,33.91
A15  (via drill 0.4)
  Top 0.4: B1.36 92.71,30.48 91.44,29.21 v75.18,29.21 | v45.85,30.23 45.15,30.93 IC9.1 IC9.2 | v51.31,44.2 51.44,44.32 56.77,44.32 57.15,43.94 66.04,43.94 66.93,44.83 73.53,44.83 v75.18,43.18
  Bottom 0.4: IC3.31 37.59,17.27 37.59,20.57 39.43,22.41 39.43,29.08 40.57,30.23 v45.85,30.23 46.35,30.23 51.31,35.18 v51.31,44.2 | v75.18,43.18 v75.18,29.21
ALE
  Bottom 0.4: IC3.33 36.83,19.05 36.83,20.95 38.78,22.91 38.78,29.55 40.48,31.24 44.27,31.24 47.62,34.6 47.62,36.83 48.9,38.1 IC4.11
C_!OE
  Bottom 0.4: IC7.22 51.44,23.5 51.44,18.44 50.77,17.78 IC5.12
C_!WE
  Top 0.4: IC5.9 52.05,12.7 IC7.27
D0
  Top 0.25: 92.71,36.83 95.25,36.83 B1.31
  Top 0.4: IC4.2 28.57,36.96 29.08,37.47 29.09,37.47 43.94,37.47 44.47,37.99 50.91,37.99 52.07,36.83 66.04,36.83 67.31,35.56 IC7.11 69.85,35.56 71.12,36.83 73.66,36.83 74.93,35.56 IC6.11 91.44,35.56 92.71,36.83
  Bottom 0.4: IC3.43 30.48,25.91 29.21,27.18 29.21,29.21 28.57,29.84 IC4.2
D1  (via drill 0.4)
  Top 0.25: 92.71,39.37 95.25,39.37 B1.29
  Top 0.4: v31.11,38.33 31.22,38.23 39.56,38.23 40.7,39.37 66.04,39.37 67.31,38.1 IC7.12 69.85,38.1 71.12,39.37 73.66,39.37 74.93,38.1 IC6.12 91.44,38.1 92.71,39.37
  Bottom 0.4: IC3.42 30.48,29.21 31.11,29.84 IC4.3 v31.11,38.33
D2  (via drill 0.4)
  Top 0.25: 92.71,41.91 95.25,41.91 B1.27
  Top 0.4: v33.66,39.12 33.78,38.99 37.34,38.99 39.02,40.67 50.7,40.67 51.94,41.91 66.04,41.91 67.31,40.64 IC7.13 69.85,40.64 71.12,41.91 73.66,41.91 74.93,40.64 IC6.13 91.44,40.64 92.71,41.91
  Bottom 0.4: IC3.41 31.75,26.67 31.75,29.84 33.66,31.75 IC4.4 v33.66,39.12
D3  (via drill 0.4)
  Top 0.4: v36.2,39.88 36.32,39.75 37.18,39.75 38.75,41.32 49.96,41.32 51.82,43.18 IC7.15 66.04,43.18 67.31,41.91 69.85,41.91 71.12,43.18 IC6.15 73.66,43.18 74.93,41.91 91.44,41.91 92.71,43.18 B1.26
  Bottom 0.4: IC3.40 33.02,29.97 36.2,33.15 IC4.5 v36.2,39.88
D4  (via drill 0.4)
  Top 0.254: 71.12,40.64 IC6.16
  Top 0.4: 71.12,40.64 69.85,39.37 67.31,39.37 66.04,40.64 IC7.16 51.69,40.64 51.07,40.02 39.64,40.02 v38.73,39.12 | IC6.16 73.66,40.64 74.93,39.37 91.44,39.37 92.71,40.64 B1.28
  Bottom 0.4: IC3.39 35.56,30.48 38.73,33.66 IC4.6 v38.73,39.12
D5  (via drill 0.4)
  Top 0.4: v41.27,38.35 41.56,38.64 51.18,38.64 51.72,38.1 IC7.17 66.04,38.1 67.31,36.83 69.85,36.83 71.12,38.1 IC6.17 73.66,38.1 74.93,36.83 91.44,36.83 92.71,38.1 B1.30
  Bottom 0.4: IC3.38 33.66,22.86 34.92,24.13 36.19,24.13 36.83,24.77 36.83,30.73 41.27,35.18 IC4.7 v41.27,38.35
D6
  Top 0.4: IC4.8 43.81,36.32 44.83,37.34 50.29,37.34 52.07,35.56 IC7.18 66.04,35.56 67.31,34.29 69.85,34.29 71.12,35.56 IC6.18 73.66,35.56 74.93,34.29 91.44,34.29 92.71,35.56 B1.32
  Bottom 0.4: IC3.37 36.07,22.86 37.48,24.27 37.48,30.34 39.91,32.77 41.78,32.77 43.81,34.8 IC4.8
D7
  Top 0.4: IC4.9 46.35,35.05 48.39,33.02 IC7.19 66.04,33.02 67.31,31.75 69.85,31.75 71.12,33.02 IC6.19 73.66,33.02 74.93,31.75 91.44,31.75 92.71,33.02 B1.34
  Bottom 0.4: IC3.36 34.29,21.59 36.2,21.59 38.13,23.52 38.13,29.94 40.16,31.97 44.04,31.97 46.35,34.29 IC4.9
D_!OE
  Top 0.4: IC6.22 71.12,25.4 69.85,24.13 52.07,24.13 51.44,23.5 51.44,22.48 50.55,21.59 45.72,21.59 44.45,20.32 IC5.4
D_!WE
  Top 0.4: IC6.27 71.12,12.7 69.85,11.43 67.31,11.43 66.04,12.7 55.88,12.7 54.61,13.97 48.39,13.97 47.12,12.7 IC5.7
GND  (via drill 0.4)
  Top 0.4: R6.1 8.17,17.35 D2.A | R8.2 22.16,1.69 Y1.4 | IC2.26 3.55,26.29 3.56,26.29 4.19,26.29 | 4.19,26.29 6.8,26.29 IC2.21 6.8,28.96 5.75,28.96 C7.2 | IC2.25 4.19,26.29
  other vias: 17.27,6.6 25.78,1.65 23.24,4.83 48.26,2.54 48.26,1.27 71.12,2.54 71.12,1.27 57.02,7.37 75.44,7.37 74.17,8.76 87.38,7.37 66.04,6.6 10.67,2.16 6.48,3.94 6.99,11.3 6.48,9.91 6.48,26.16 3.81,26.16 9.53,26.16 11.94,26.16 4.32,29.72 7.62,31.37 11.05,31.11 9.91,33.66 2.29,46.1 2.67,52.58 0.76,50.16 12.83,52.58 7.11,52.58 18.41,52.58 21.59,50.93 15.24,48.39 12.57,45.72 31.75,21.59 30.1,18.16 21.59,24.13 21.46,19.05 30.48,23.75 25.78,19.05 39.62,10.16 66.55,48.39 87.63,45.09 66.04,50.8 66.04,52.07 43.69,50.8 43.69,52.07 99.57,5.08 99.57,11.43 99.57,17.78 99.57,24.13 99.57,30.48 99.57,36.83 93.98,5.08 92.2,7.11 89.41,4.32 76.96,43.18 73.79,46.1 67.18,46.1 81.53,7.37 9.02,14.35 6.22,21.97 3.17,21.97 9.65,21.97 11.05,17.53 12.83,18.29 13.84,16.89 29.08,46.61 26.04,37.85 26.16,31.37 26.04,39.62 46.61,32 0.76,45.09 0.76,38.86 3.3,37.47 3.3,34.92 7.49,35.43 7.49,38.1 8.51,41.15 6.48,6.6 1.27,3.81 5.46,0.76 11.94,1.02 39.37,1.02 44.45,1.02 96.52,5.08 26.8,45.21 35.94,47.75 9.4,50.29 4.32,50.16 19.68,39.37 19.68,37.47 15.88,31.11 15.88,28.57 25.65,22.86 23.37,19.05 31.37,15.24 29.84,41.27 34.92,41.27 19.81,33.66 13.84,39.24 40.01,36.58 34.92,33.66 29.84,33.66 37.08,10.16 15.24,8.76 85.34,43.18 98.3,49.53 95.25,52.45 85.09,52.45 51.56,7.49 23.88,21.21 22.61,22.48 28.57,21.59 92.46,44.45 88.65,48.01 92.46,46.99 92.33,12.32 12.57,35.43 55.63,9.02 47.24,25.4 68.83,8.76 48.13,11.43 48.13,9.02 46.74,20.32 20.32,31.11 9.4,46.74 9.4,44.58 13.84,6.73 19.81,4.83 75.44,11.43 92.33,25.02 75.18,24.13 85.98,24.13 70.99,6.99 89.28,24.13 89.28,11.43 85.98,11.43 89.92,43.18 32.38,33.66 28.32,38.23 24.13,14.1 29.21,14.1 50.29,35.56
  pour Bottom (isolate 0.25): 0,53.34 0,0 101.6,0 101.6,53.34
  pour Top (isolate 0.25): 0,53.34 0,0 101.6,0 101.6,53.34
M_!EN
  Top 0.4: IC6.20 71.12,30.48 69.85,29.21 67.31,29.21 66.04,30.48 IC7.20 51.56,30.48 49.91,32.13 48.26,32.13 46.74,33.66 43.69,33.66 42.86,32.83 IC9.4
MISO  (via drill 0.4)
  Top 0.4: B1.12 30.1,49.4 28.7,49.4 27.94,48.64 19.43,48.64 v19.05,48.26 | v15.49,25.53 17.02,27.05 19.18,27.05 20.32,25.91 IC3.8
  Bottom 0.4: IC3.8 20.32,25.91 19.05,27.18 19.05,32.55 17.78,33.81 17.78,40.64 19.05,41.91 IC1.2 v19.05,48.26 | J1.1 4.19,18.29 8.26,18.29 v15.49,25.53
MOSI  (via drill 0.4)
  Top 0.4: B1.11 32.64,52.2 20.45,52.2 v18.16,49.91
  Bottom 0.4: J1.4 15.11,24.13 16.51,24.13 IC3.7 17.78,26.16 17.53,26.42 17.53,31.62 13.97,35.18 IC1.5 13.97,35.94 15.24,37.21 15.24,44.32 16.89,45.97 16.89,48.64 v18.16,49.91
N$10
  Top 0.4: C9.2 17.8,1.67 Y1.3 20.59,1.67 20.95,2.03 20.95,8.26 IC3.20
N$11
  Top 0.4: R8.1 24.11,3.42 Y1.1 22.13,7.5 24.11,9.47 24.11,11.45 IC3.21
N$12  (via drill 0.4)
  Top 0.4: R6.2 R7.2 | D2.C 9.87,17.35 R6.2 | C6.2 12.57,14.73 11.94,15.37 v11.05,15.37 R6.2 | S1.1 6.45,2.18 v6.48,2.16
  Bottom 0.4: v6.48,2.16 6.54,2.16 9.78,5.4 9.78,13.97 11.05,15.24 v11.05,15.37
N$20
  Top 0.4: R5.1 D3.A
N$21
  Top 0.4: D4.A 29.18,1.66 R9.1
N$23
  Top 0.4: IC2.16 10.05,28.69 10.32,28.96 11.94,28.96 12.45,29.46 12.45,30.96 11.41,31.99 8.37,31.99 4.43,35.93 4.43,38.97 5.99,40.53 7.34,40.53 X1.2
N$24
  Top 0.4: C8.1 9.4,29.88 IC2.17
N$25
  Top 0.4: X1.3 5.08,37.91 5.08,36.2 8.64,32.64 11.68,32.64 13.1,31.23 13.1,29.2 11.66,27.75 IC2.15
N$27
  Top 0.4: FB1.1 C2.1 11.22,35.39 12.2,34.41 12.2,33.14 13.84,31.5 13.84,28.92 13.21,28.28 R3.2
  Top 1.016: X1.1 8.54,36.87 FB1.1
N$29
  Top 0.4: IC1.3 R1.2 17.99,45.76 Q1.C
N$31
  Top 1.016: FB1.2 D1.A
N$41
  Top 0.4: R4.2 R3.1 9.23,24.55 8.1,25.68 IC2.19
P1.0  (via drill 0.4)
  Top 0.4: v27.69,4.95 v27.69,4.94 27.3,4.56 D4.C | B1.8 40.13,49.28 38.86,49.28 38.23,48.64 31.62,48.64 30.73,47.75 v29.59,47.75
  Bottom 0.4: v27.69,4.95 26.67,5.97 26.67,26.16 25.4,27.43 IC3.2 25.4,28.32 24.64,29.08 24.64,44.32 28.07,47.75 v29.59,47.75
P1.1  (via drill 0.4)
  Top 0.4: v10.67,8.51 9.04,8.51 | S2.2 9.04,8.51 | R11.1 9.04,10.43 9.04,8.51 | B1.9 37.72,49.4 31.24,49.4 30.48,48.64 29.08,48.64 28.19,47.75 v26.8,47.75
  Bottom 0.4: v10.67,8.51 10.67,13.72 11.94,14.99 11.94,18.83 14.68,21.57 22.84,21.57 25.4,24.13 IC3.3 24.13,26.67 24.13,28.57 23.75,28.96 23.75,44.7 v26.8,47.75
P3.2  (via drill 0.4)
  Top 0.4: v63.25,6.73 62.87,7.11 62.05,7.11 61.29,6.35 30.61,6.35 28.57,8.38 26.29,8.38 v25.87,7.96
  Bottom 0.4: B1.2 60.2,49.02 61.98,49.02 64.14,46.86 64.14,12.32 63.25,11.43 v63.25,6.73 | IC3.14 19.05,16.51 19.05,9.53 20.32,8.26 25.57,8.26 v25.87,7.96
P3.3  (via drill 0.4)
  Top 0.4: v25,7.15 26.27,7.15 26.65,7.53 28.41,7.53 30.23,5.71 61.98,5.71 v62.36,6.1
  Bottom 0.4: B1.3 58.42,48.26 61.59,48.26 63.25,46.61 63.25,12.57 62.36,11.68 v62.36,6.1 | IC3.15 16.38,13.84 16.38,11.18 20.07,7.49 24.64,7.49 24.98,7.15 v25,7.15
P3.4  (via drill 0.4)
  Top 0.4: IC3.16 20.95,15.24 22.61,16.89 v27.68,16.89
  Bottom 0.4: B1.4 53.34,50.29 50.67,47.62 40.64,47.62 37.47,44.45 37.47,33.4 34.29,30.23 34.29,24.64 33.78,24.13 32.38,24.13 28.57,20.32 28.57,17.53 27.94,16.89 v27.68,16.89
P3.5  (via drill 0.4)
  Top 0.4: IC3.17 19.05,13.97 19.05,16 19.56,16.51 21.08,16.51 22.61,18.03 v27.69,18.03
  Bottom 0.4: B1.5 50.8,50.16 49.02,48.39 40.26,48.39 37.34,45.47 28.44,45.47 27.3,44.33 27.3,29.84 26.67,29.21 26.67,27.3 27.3,26.67 28.57,26.67 29.21,26.04 29.21,24.77 27.69,23.24 v27.69,18.03
RST
  Top 0.25: 6.22,12.95 3.94,12.95 J1.5
  Top 0.4: IC3.10 19.05,21.59 19.05,17.28 18.28,16.51 16.89,16.51 14.35,13.97 14.35,12.34 | 8.17,12.34 14.35,12.34 | R7.1 8.17,12.34 | 6.22,12.95 6.84,12.34 8.17,12.34 | B1.RESET 31.11,0.64 17.02,0.64 16.64,1.02 16.64,5.97 14.35,8.26 14.35,12.34
RX  (via drill 0.4)
  Top 0.4: IC2.1 2.25,22.84 3.04,23.62 11.68,23.62 12.19,23.11 12.19,20.7 12.57,20.32 IC3.11 | v25.02,5.46 26.8,5.46 27.3,5.97 27.94,5.97 29.46,4.45 63.88,4.45 v65.09,5.66
  Bottom 0.4: B1.0 63.5,49.78 65.91,47.37 65.91,11.85 65.09,11.03 v65.09,5.66 | IC3.11 14.86,17.4 14.86,10.41 19.3,5.97 23.75,5.97 24.26,5.46 v25.02,5.46
SCK  (via drill 0.4)
  Top 0.4: B1.13 27.56,49.4 19.05,49.4 17.78,48.13 v17.78,48.01
  Bottom 0.25: 6.22,12.95 3.94,12.95 J1.3
  Bottom 0.4: v17.78,48.01 17.78,41.91 16.51,40.64 IC1.6 16.51,33.91 18.29,32.13 18.29,26.8 19.03,26.05 19.03,24.75 17.78,23.5 IC3.9 14.89,22.86 6.73,14.7 6.73,13.46 6.22,12.95
TX  (via drill 0.4)
  Top 0.4: IC2.5 4.85,19.57 5.12,19.3 16.26,19.3 IC3.13 | v25.78,6.35 26.54,6.35 26.92,6.73 28.19,6.73 29.84,5.08 63.2,5.08 v64.08,5.97
  Bottom 0.4: B1.1 61.34,50.8 65.02,47.12 65.02,12.06 64.14,11.18 64.14,5.97 v64.08,5.97 | IC3.13 15.62,15.62 15.62,10.79 19.68,6.73 24,6.73 24.39,6.35 v25.78,6.35

### Text on the board
Top: RETRODUINO-S1